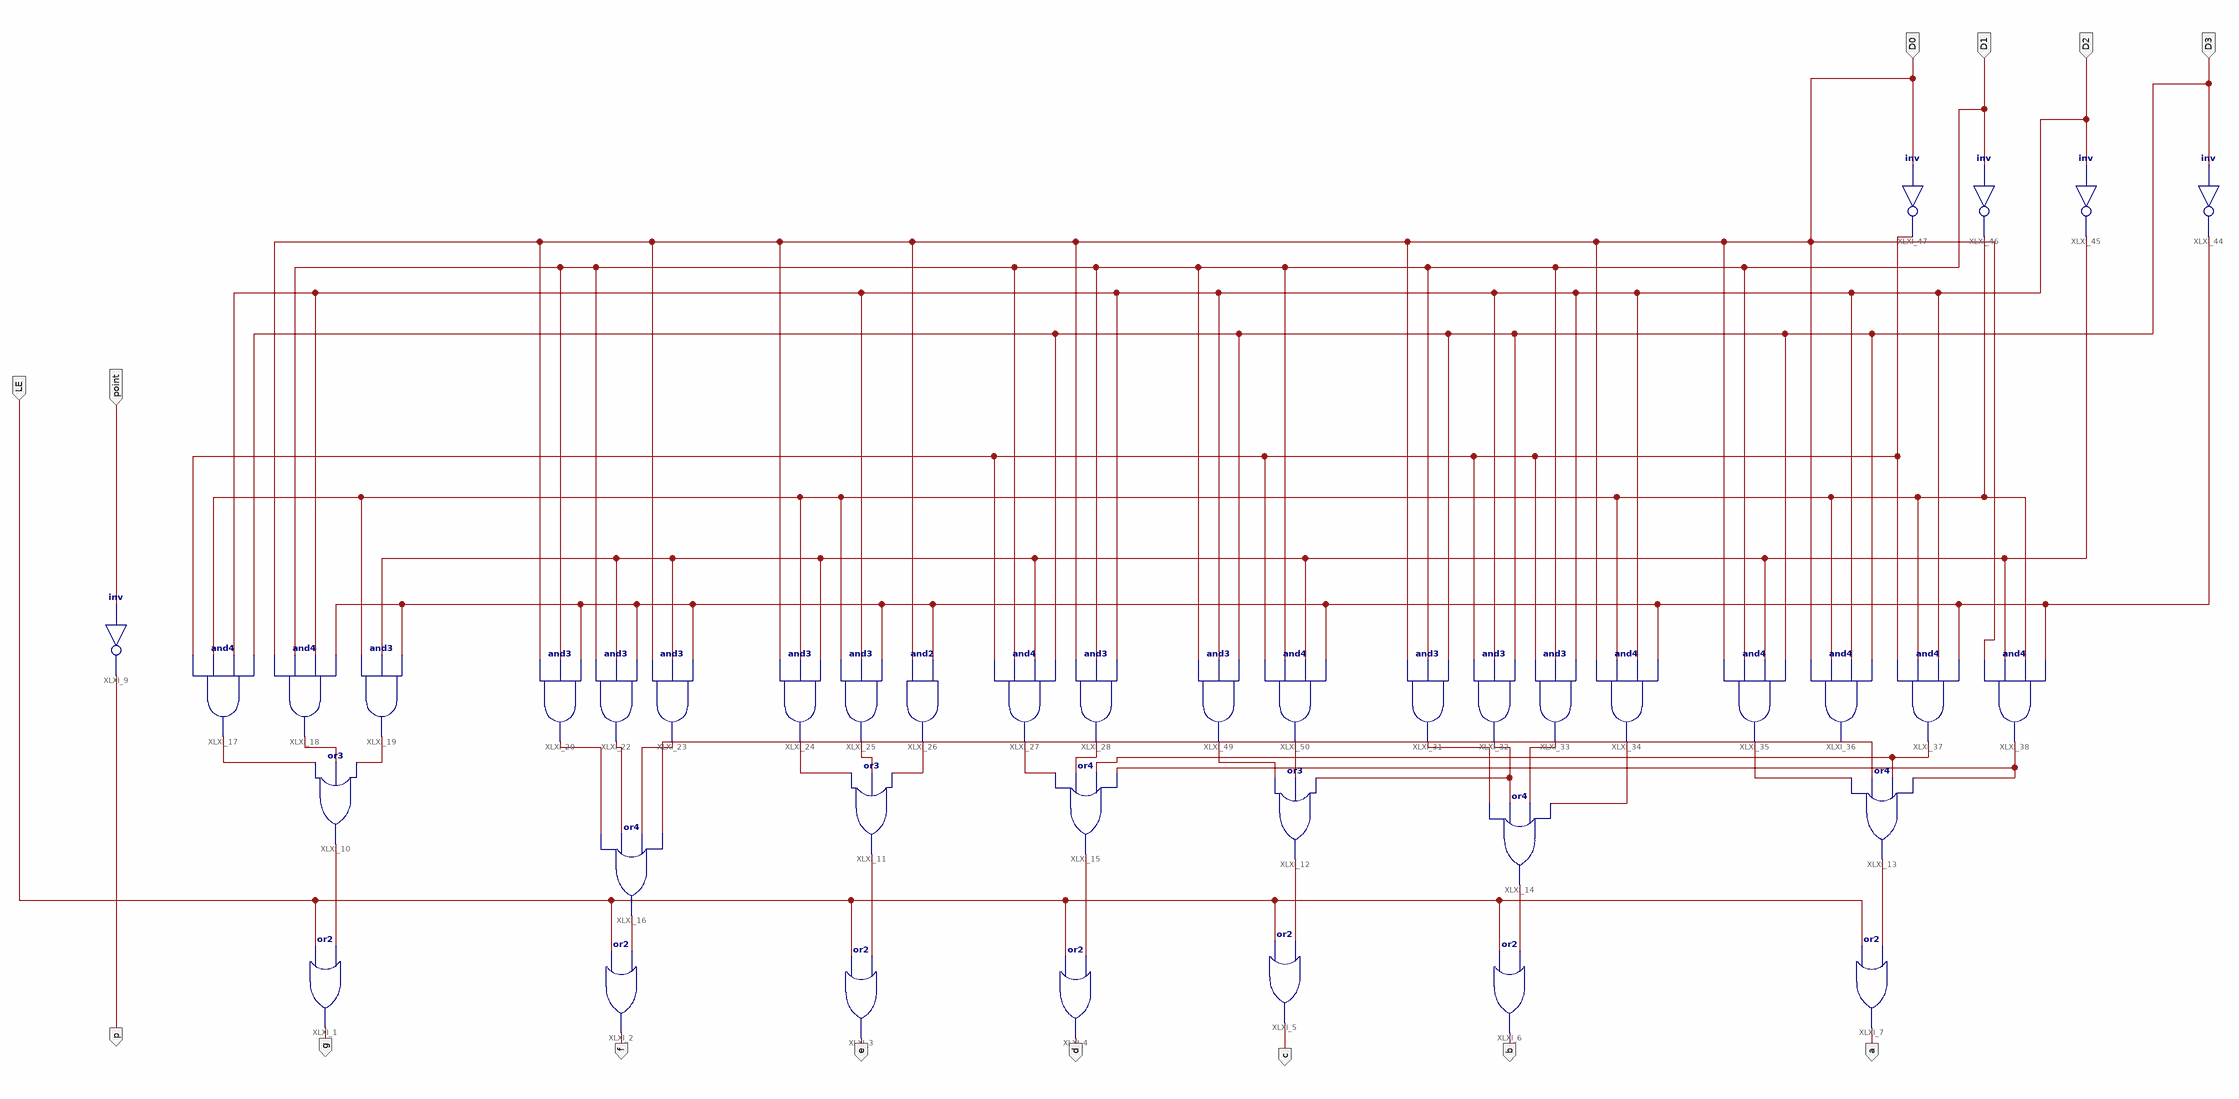
[diagram p0: schematic sheet 1]
// Xilinx ISE schematic MyMC14495.sch (kintex7) as structural Verilog: 40 symbols, 14 ports
module MyMC14495 (
  input  LE,
  input  point,
  input  D3,
  input  D2,
  input  D1,
  input  D0,
  output g,
  output f,
  output e,
  output d,
  output c,
  output b,
  output a,
  output p
);

  wire XLXN_18, XLXN_19, XLXN_20, XLXN_21, XLXN_22, XLXN_23, XLXN_24, XLXN_26, XLXN_29, XLXN_34, XLXN_35,
       XLXN_36, XLXN_37, XLXN_40, XLXN_41, XLXN_42, XLXN_43, XLXN_44, XLXN_45, XLXN_46, XLXN_47, XLXN_48,
       XLXN_49, XLXN_50, XLXN_64, XLXN_65, XLXN_66, XLXN_68, XLXN_85, XLXN_87, XLXN_94, XLXN_100;

  or XLXI_1 (g, LE, XLXN_18);
  or XLXI_2 (f, LE, XLXN_19);
  or XLXI_3 (e, LE, XLXN_20);
  or XLXI_4 (d, LE, XLXN_21);
  or XLXI_5 (c, LE, XLXN_22);
  or XLXI_6 (b, LE, XLXN_23);
  or XLXI_7 (a, LE, XLXN_24);
  not XLXI_9 (p, point);
  or XLXI_10 (XLXN_18, XLXN_65, XLXN_66, XLXN_68);
  or XLXI_11 (XLXN_20, XLXN_47, XLXN_46, XLXN_45);
  or XLXI_12 (XLXN_22, XLXN_40, XLXN_41, XLXN_36);
  or XLXI_13 (XLXN_24, XLXN_29, XLXN_64, XLXN_44, XLXN_26);
  or XLXI_14 (XLXN_23, XLXN_37, XLXN_36, XLXN_35, XLXN_34);
  or XLXI_15 (XLXN_21, XLXN_42, XLXN_43, XLXN_44, XLXN_26);
  or XLXI_16 (XLXN_19, XLXN_48, XLXN_49, XLXN_50, XLXN_64);
  and XLXI_17 (XLXN_65, XLXN_94, XLXN_87, D2, D3);
  and XLXI_18 (XLXN_66, D0, D1, D2, XLXN_100);
  and XLXI_19 (XLXN_68, XLXN_87, XLXN_85, XLXN_100);
  and XLXI_20 (XLXN_48, D0, D1, XLXN_100);
  and XLXI_22 (XLXN_49, D1, XLXN_85, XLXN_100);
  and XLXI_23 (XLXN_50, D0, XLXN_85, XLXN_100);
  and XLXI_24 (XLXN_47, D0, XLXN_87, XLXN_85);
  and XLXI_25 (XLXN_46, XLXN_87, D2, XLXN_100);
  and XLXI_26 (XLXN_45, D0, XLXN_100);
  and XLXI_27 (XLXN_42, XLXN_94, D1, XLXN_85, D3);
  and XLXI_28 (XLXN_43, D0, D1, D2);
  and XLXI_31 (XLXN_37, D0, D1, D3);
  and XLXI_32 (XLXN_36, XLXN_94, D2, D3);
  and XLXI_33 (XLXN_35, XLXN_94, D1, D2);
  and XLXI_34 (XLXN_34, D0, XLXN_87, D2, XLXN_100);
  and XLXI_35 (XLXN_29, D0, D1, XLXN_85, D3);
  and XLXI_36 (XLXN_64, D0, XLXN_87, D2, D3);
  and XLXI_37 (XLXN_44, XLXN_94, XLXN_87, D2, XLXN_100);
  and XLXI_38 (XLXN_26, D0, XLXN_85, XLXN_87, XLXN_100);
  not XLXI_44 (XLXN_100, D3);
  not XLXI_45 (XLXN_85, D2);
  not XLXI_46 (XLXN_87, D1);
  not XLXI_47 (XLXN_94, D0);
  and XLXI_49 (XLXN_40, D1, D2, D3);
  and XLXI_50 (XLXN_41, XLXN_94, D1, XLXN_85, XLXN_100);
endmodule
